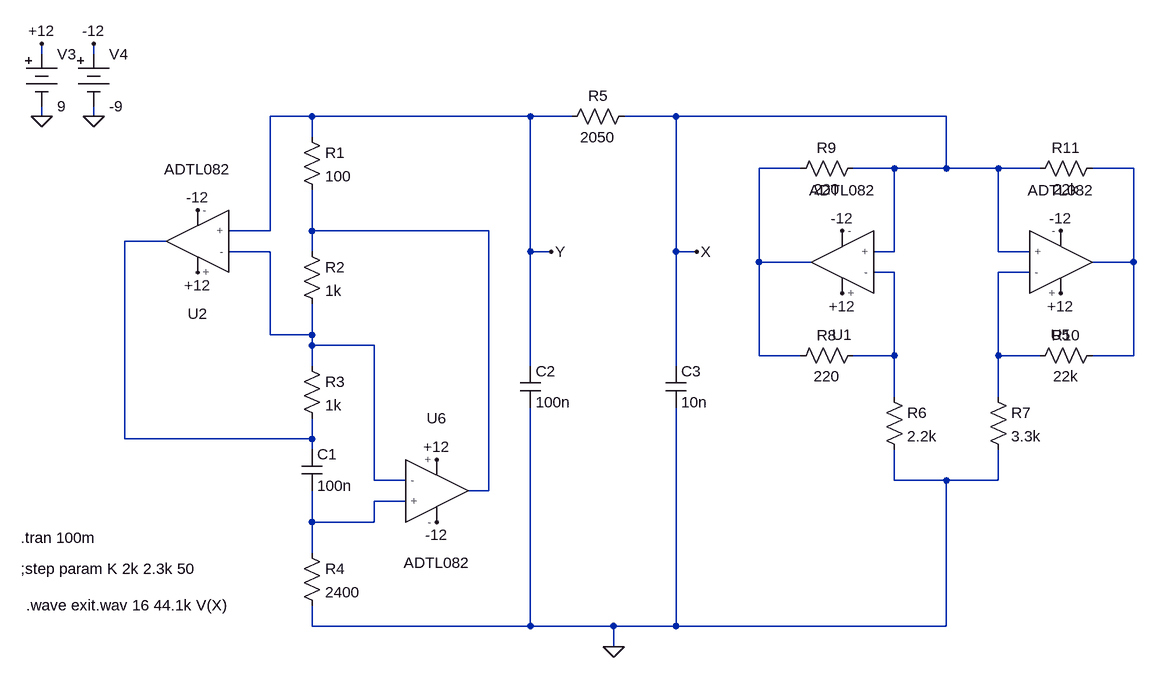
[diagram p0: schematic CHUA_1.asc]
CHUA_1.asc, the LTspice schematic file:
Version 4
SHEET 1 1424 756
WIRE -272 -176 -272 -192
WIRE -192 -176 -192 -192
WIRE -272 -80 -272 -96
WIRE -192 -80 -192 -96
WIRE 144 -80 80 -80
WIRE 480 -80 144 -80
WIRE 544 -80 480 -80
WIRE 704 -80 624 -80
WIRE 1120 -80 704 -80
WIRE 144 -48 144 -80
WIRE 896 0 832 0
WIRE 1040 0 976 0
WIRE 1120 0 1120 -80
WIRE 1120 0 1040 0
WIRE 1200 0 1120 0
WIRE 1264 0 1200 0
WIRE 1408 0 1344 0
WIRE 80 96 80 -80
WIRE 80 96 16 96
WIRE 144 96 144 32
WIRE 416 96 144 96
WIRE -80 112 -144 112
WIRE 80 128 16 128
WIRE 144 128 144 96
WIRE 480 128 480 -80
WIRE 512 128 480 128
WIRE 704 128 704 -80
WIRE 736 128 704 128
WIRE 1040 128 1040 0
WIRE 1040 128 1008 128
WIRE 1200 128 1200 0
WIRE 1248 128 1200 128
WIRE 832 144 832 0
WIRE 912 144 832 144
WIRE 1408 144 1408 0
WIRE 1408 144 1344 144
WIRE 1040 160 1008 160
WIRE 1248 160 1200 160
WIRE 80 256 80 128
WIRE 144 256 144 208
WIRE 144 256 80 256
WIRE 144 272 144 256
WIRE 240 272 144 272
WIRE 832 288 832 144
WIRE 896 288 832 288
WIRE 1040 288 1040 160
WIRE 1040 288 976 288
WIRE 1200 288 1200 160
WIRE 1264 288 1200 288
WIRE 1408 288 1408 144
WIRE 1408 288 1344 288
WIRE 144 304 144 272
WIRE 480 304 480 128
WIRE 704 304 704 128
WIRE 1040 352 1040 288
WIRE 1200 352 1200 288
WIRE -144 416 -144 112
WIRE 144 416 144 384
WIRE 144 416 -144 416
WIRE 144 432 144 416
WIRE 240 480 240 272
WIRE 288 480 240 480
WIRE 1040 480 1040 432
WIRE 1120 480 1040 480
WIRE 1200 480 1200 432
WIRE 1200 480 1120 480
WIRE 416 496 416 96
WIRE 416 496 384 496
WIRE 288 512 240 512
WIRE 144 544 144 496
WIRE 240 544 240 512
WIRE 240 544 144 544
WIRE 144 592 144 544
WIRE 144 704 144 672
WIRE 480 704 480 368
WIRE 480 704 144 704
WIRE 608 704 480 704
WIRE 704 704 704 368
WIRE 704 704 608 704
WIRE 1120 704 1120 480
WIRE 1120 704 704 704
WIRE 608 736 608 704
FLAG -272 -80 0
FLAG -192 -80 0
FLAG -272 -192 +12
FLAG -192 -192 -12
FLAG 1296 192 +12
FLAG 960 192 +12
FLAG 960 96 -12
FLAG 1296 96 -12
FLAG 608 736 0
FLAG 512 128 Y
FLAG 736 128 X
FLAG -32 160 +12
FLAG -32 64 -12
FLAG 336 448 +12
FLAG 336 544 -12
SYMBOL Misc\\battery -272 -192 R0
WINDOW 123 0 0 Left 0
WINDOW 39 0 0 Left 0
SYMATTR InstName V3
SYMATTR Value 9
SYMBOL Misc\\battery -192 -192 R0
WINDOW 123 0 0 Left 0
WINDOW 39 0 0 Left 0
SYMATTR InstName V4
SYMATTR Value -9
SYMBOL res 128 -64 R0
SYMATTR InstName R1
SYMATTR Value 100
SYMBOL res 128 112 R0
SYMATTR InstName R2
SYMATTR Value 1k
SYMBOL res 128 288 R0
SYMATTR InstName R3
SYMATTR Value 1k
SYMBOL res 128 576 R0
SYMATTR InstName R4
SYMATTR Value 2400
SYMBOL cap 128 432 R0
SYMATTR InstName C1
SYMATTR Value 100n
SYMBOL cap 464 304 R0
SYMATTR InstName C2
SYMATTR Value 100n
SYMBOL cap 688 304 R0
SYMATTR InstName C3
SYMATTR Value 10n
SYMBOL res 640 -96 R90
WINDOW 0 0 56 VBottom 2
WINDOW 3 32 56 VTop 2
SYMATTR InstName R5
SYMATTR Value 2050
SYMBOL res 1024 336 R0
SYMATTR InstName R6
SYMATTR Value 2.2k
SYMBOL res 1184 336 R0
SYMATTR InstName R7
SYMATTR Value 3.3k
SYMBOL res 992 272 R90
WINDOW 0 0 56 VBottom 2
WINDOW 3 32 56 VTop 2
SYMATTR InstName R8
SYMATTR Value 220
SYMBOL res 992 -16 R90
WINDOW 0 0 56 VBottom 2
WINDOW 3 32 56 VTop 2
SYMATTR InstName R9
SYMATTR Value 220
SYMBOL res 1360 272 R90
WINDOW 0 0 56 VBottom 2
WINDOW 3 32 56 VTop 2
SYMATTR InstName R10
SYMATTR Value 22k
SYMBOL res 1360 -16 R90
WINDOW 0 0 56 VBottom 2
WINDOW 3 32 56 VTop 2
SYMATTR InstName R11
SYMATTR Value 22k
SYMBOL component\\ADTL082 1280 144 M180
SYMATTR InstName U5
SYMBOL component\\ADTL082 976 144 R180
SYMATTR InstName U1
SYMBOL component\\ADTL082 -16 112 R180
SYMATTR InstName U2
SYMBOL component\\ADTL082 320 496 R0
SYMATTR InstName U6
TEXT -304 568 Left 2 !.tran 100m
TEXT -304 616 Left 2 !;step param K 2k 2.3k 50
TEXT -296 672 Left 2 !.wave exit.wav 16 44.1k V(X)

The netlist it stands for:
* CHUA_1.asc
V3 +12 0 9
V4 -12 0 -9
R1 Y N003 100
R2 N003 N005 1k
R3 N005 N004 1k
R4 N008 0 2400
C1 N004 N008 100n
C2 Y 0 100n
C3 X 0 10n
R5 X Y 2050
R6 N006 0 2.2k
R7 N007 0 3.3k
R8 N006 N001 220
R9 X N001 220
R10 N002 N007 22k
R11 N002 X 22k
XU5 X N007 +12 -12 N002 ADTL082  ; pins + - + - ?
XU1 X N006 +12 -12 N001 ADTL082  ; pins + - + - ?
XU2 Y N005 +12 -12 N004 ADTL082  ; pins + - + - ?
XU6 N008 N005 +12 -12 N003 ADTL082  ; pins + - + - ?
.tran 100m
;step param K 2k 2.3k 50
.wave exit.wav 16 44.1k V(X)
.lib C:\Users\franc\AppData\Local\LTspice\cir\adtl082.cir
.backanno
.end